# Altium project FAFMACMU_ControlPanel-V3-031115.PrjPcb
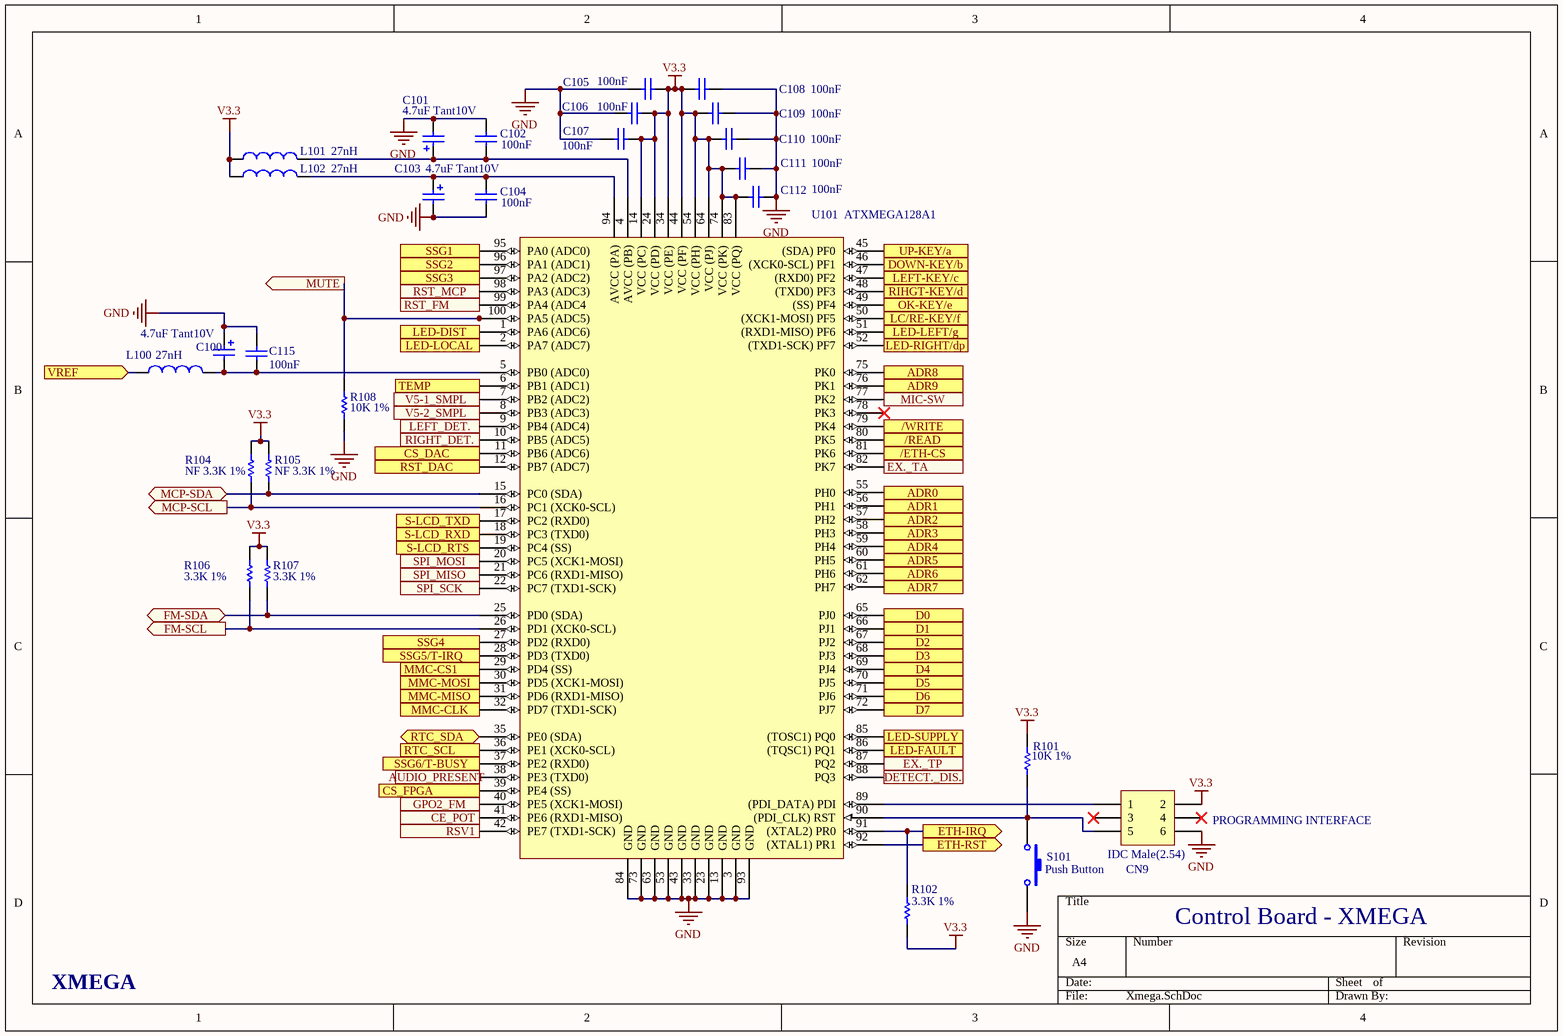
[diagram p0: Xmega.SchDoc]
4 sheets, 185 parts. Net scope: flat (ports and power ports of the same name join across sheets).
Board file: FAFMACMU_ControlPanel-V3-031115.PcbDoc
Sheets:
  Xmega.SchDoc
  Peripherals.SchDoc
  Ethernet & LCD.SchDoc
  Peripherals 2.SchDoc

## Sheet Xmega.SchDoc
size A4; PageSetup: Record=PageOptions|CenterHorizontal=True|CenterVertical=True|PrintScale=0.97|XCorrection=1.00|YCorrection=1.00|PrintKind=1|BorderSize=5000000|LeftOffset=0|BottomOffset=0|Orientation=2|PaperLength=2970|PaperWidth=1000|Scale=100|PaperSource=257|PrintQuality=600|MediaType=1|DitherType=10|PaperKind=A4|PrintScaleMode=1

### Parts
C100  4.7uF Tant10V  [CAP-TAN]
C101  4.7uF Tant10V  [A]
C102  100nF  [1206_FA]
C103  4.7uF Tant10V  [A]
C104  100nF  [1206_FA]
C105  100nF  [1206_FA]
C106  100nF  [1206_FA]
C107  100nF  [1206_FA]
C108  100nF  [1206_FA]
C109  100nF  [1206_FA]
C110  100nF  [1206_FA]
C111  100nF  [1206_FA]
C112  100nF  [1206_FA]
C115  100nF  [0805_FA]
CN9  IDC Male(2.54)  [HDR2X3_M]
L100  27nH  [1210_FA]
L101  27nH  [1210_FA]
L102  27nH  [1210_FA]
R101  10K 1%  [1206_FA]
R102  3.3K 1%  [1206_FA]
R104  NF 3.3K 1%  [1206_FA]
R105  NF 3.3K 1%  [1206_FA]
R106  3.3K 1%  [1206_FA]
R107  3.3K 1%  [1206_FA]
R108  10K 1%  [1206_FA]
S101  Push Button  [SPS2_M(2Pin)]
U101  ATXMEGA128A1  [100T1_N]

### Ports
/ETH-CS (out), /READ (out), /WRITE (out), ADR0 (out), ADR1 (out), ADR2 (out), ADR3 (out), ADR4 (out), ADR5 (out), ADR6 (out), ADR7 (out), ADR8 (out), ADR9 (out), AUDIO_PRESENT (out), CE_POT (in), CS_DAC (out), CS_FPGA (out), D0 (out), D1 (out), D2 (out), D3 (out), D4 (out), D5 (out), D6 (out), D7 (out), DETECT._DIS. (out), DOWN-KEY/b (out), ETH-IRQ (out), ETH-RST (out), EX._TA (out), EX._TP (out), FM-SCL (out), FM-SDA (bidir), GPO2_FM (out), LC/RE-KEY/f (out), LED-DIST (in), LED-FAULT (out), LED-LEFT/g (out), LED-LOCAL (in), LED-RIGHT/dp (out), LED-SUPPLY (out), LEFT-KEY/c (out), LEFT_DET. (in), MCP-SCL (out), MCP-SDA (bidir), MIC-SW (out), MMC-CLK (out), MMC-CS1 (out), MMC-MISO (in), MMC-MOSI (out), MUTE (out), OK-KEY/e (out), RIGHT_DET. (in), RIHGT-KEY/d (out), RST_DAC (out), RST_FM (out), RST_MCP (out), RSV1 (in), RTC_SCL (out), RTC_SDA (bidir), S-LCD_RTS (in), S-LCD_RXD (in), S-LCD_TXD (in), SPI_MISO (out), SPI_MOSI (out), SPI_SCK (out), SSG1 (in), SSG2 (in), SSG3 (in), SSG4 (out), SSG5/T-IRQ (out), SSG6/T-BUSY (out), TEMP (out), UP-KEY/a (out), V5-1_SMPL (in), V5-2_SMPL (in), VREF (in)

### Nets
GND: C100.1 C101.2 C102.2 C103.2 C104.1 C105.2 C106.2 C107.2 C108.1 C109.1 C110.1 C111.1 C112.1 C115.2 CN9.6 R108.1 S101.2 U101.3(GND) U101.13(GND) U101.23(GND) U101.33(GND) U101.43(GND) U101.53(GND) U101.63(GND) U101.73(GND) U101.84(GND) U101.93(GND)
V3.3: C105.1 C106.1 C107.1 C108.2 C109.2 C110.2 C111.2 C112.2 CN9.2 L101.1 L102.1 R101.2 R102.1 R104.2 R105.2 R106.2 R107.2 U101.14(VCC_(PC)) U101.24(VCC_(PD)) U101.34(VCC_(PE)) U101.44(VCC_(PF)) U101.54(VCC_(PH)) U101.64(VCC_(PJ)) U101.74(VCC_(PK)) U101.83(VCC_(PQ))
NetC100_2: C100.2 C115.1 L100.2 U101.5(PB0_(ADC0))
NetC101_1: C101.1 C102.1 L101.2 U101.4(AVCC_(PB))
NetC103_1: C103.1 C104.2 L102.2 U101.94(AVCC_(PA))
NetC314_2: U101.45((SDA)_PF0) ; port UP-KEY/a
NetC315_2: U101.46((XCK0-SCL)_PF1) ; port DOWN-KEY/b
NetC316_2: U101.47((RXD0)_PF2) ; port LEFT-KEY/c
NetC317_2: U101.48((TXD0)_PF3) ; port RIHGT-KEY/d
NetC318_2: U101.49((SS)_PF4) ; port OK-KEY/e
NetC319_2: U101.50((XCK1-MOSI)_PF5) ; port LC/RE-KEY/f
NetC403_2: U101.6(PB1_(ADC1)) ; port TEMP
NetCN9_1: CN9.1 U101.89((PDI_DATA)_PDI)
NetCN9_5: CN9.5 R101.1 S101.1 U101.90((PDI_CLK)_RST)
NetCN102_2: U101.98(PA3_(ADC3)) ; port RST_MCP
NetCN102_3: U101.11(PB6_(ADC6)) ; port CS_DAC
NetCN102_4: U101.20(PC5_(XCK1-MOSI)) ; port SPI_MOSI
NetCN102_5: U101.12(PB7_(ADC7)) ; port RST_DAC
NetCN102_6: U101.21(PC6_(RXD1-MISO)) ; port SPI_MISO
NetCN102_7: U101.22(PC7_(TXD1-SCK)) ; port SPI_SCK
NetCN102_8: U101.39(PE4_(SS)) ; port CS_FPGA
NetCN102_9: R107.1 U101.25(PD0_(SDA)) ; port FM-SDA
NetCN102_10: U101.99(PA4_(ADC4) ; port RST_FM
NetCN102_11: U101.40(PE5_(XCK1-MOSI)) ; port GPO2_FM
NetCN102_12: R106.1 U101.26(PD1_(XCK0-SCL)) ; port FM-SCL
NetCN102_13: U101.87(PQ2) ; port EX._TP
NetCN102_14: U101.88(PQ3) ; port DETECT._DIS.
NetCN102_15: U101.38(PE3_(TXD0)) ; port AUDIO_PRESENT
NetCN102_16: U101.77(PK2) ; port MIC-SW
NetCN102_17: U101.82(PK7) ; port EX._TA
NetCN102_18: R108.2 U101.100(PA5_(ADC5)) ; port MUTE
NetCN102_19: U101.41(PE6_(RXD1-MISO)) ; port CE_POT
NetCN102_20: U101.9(PB4_(ADC4)) ; port LEFT_DET.
NetCN102_21: U101.7(PB2_(ADC2)) ; port V5-1_SMPL
NetCN102_22: U101.10(PB5_(ADC5)) ; port RIGHT_DET.
NetCN102_23: U101.8(PB3_(ADC3)) ; port V5-2_SMPL
NetCN102_27: R105.1 U101.15(PC0_(SDA)) ; port MCP-SDA
NetCN102_29: R104.1 U101.16(PC1_(XCK0-SCL)) ; port MCP-SCL
NetCN103_7: U101.51((RXD1-MISO)_PF6) ; port LED-LEFT/g
NetCN103_8: U101.52((TXD1-SCK)_PF7) ; port LED-RIGHT/dp
NetCN103_10: U101.95(PA0_(ADC0)) ; port SSG1
NetCN103_12: U101.96(PA1_(ADC1)) ; port SSG2
NetCN103_14: U101.97(PA2_(ADC2)) ; port SSG3
NetCN104_10: U101.27(PD2_(RXD0)) ; port SSG4
NetCN104_12: U101.28(PD3_(TXD0)) ; port SSG5/T-IRQ
NetCN104_14: U101.37(PE2_(RXD0)) ; port SSG6/T-BUSY
NetE400_1: U101.18(PC3_(TXD0)) ; port S-LCD_RXD
NetE401_1: U101.19(PC4_(SS)) ; port S-LCD_RTS
NetE402_1: U101.17(PC2_(RXD0)) ; port S-LCD_TXD
NetL100_1: L100.1 ; port VREF
NetLED105_K: U101.2(PA7_(ADC7)) ; port LED-LOCAL
NetLED106_A: U101.86((TQSC1)_PQ1) ; port LED-FAULT
NetR102_2: R102.2 U101.91((XTAL2)_PR0) ; port ETH-IRQ
NetR301_2: U101.31(PD6_(RXD1-MISO)) ; port MMC-MISO
NetR302_2: U101.32(PD7_(TXD1-SCK)) ; port MMC-CLK
NetR303_2: U101.30(PD5_(XCK1-MOSI)) ; port MMC-MOSI
NetR304_2: U101.29(PD4_(SS)) ; port MMC-CS1
NetR312_1: U101.1(PA6_(ADC6)) ; port LED-DIST
NetR315_1: U101.85((TOSC1)_PQ0) ; port LED-SUPPLY
NetR405_1: U101.35(PE0_(SDA)) ; port RTC_SDA
NetR406_1: U101.36(PE1_(XCK0-SCL)) ; port RTC_SCL
NetU101_42: U101.42(PE7_(TXD1-SCK)) ; port RSV1
NetU101_55: U101.55(PH0) ; port ADR0
NetU101_56: U101.56(PH1) ; port ADR1
NetU101_57: U101.57(PH2) ; port ADR2
NetU101_58: U101.58(PH3) ; port ADR3
NetU101_59: U101.59(PH4) ; port ADR4
NetU101_60: U101.60(PH5) ; port ADR5
NetU101_61: U101.61(PH6) ; port ADR6
NetU101_62: U101.62(PH7) ; port ADR7
NetU101_65: U101.65(PJ0) ; port D0
NetU101_66: U101.66(PJ1) ; port D1
NetU101_67: U101.67(PJ2) ; port D2
NetU101_68: U101.68(PJ3) ; port D3
NetU101_69: U101.69(PJ4) ; port D4
NetU101_70: U101.70(PJ5) ; port D5
NetU101_71: U101.71(PJ6) ; port D6
NetU101_72: U101.72(PJ7) ; port D7
NetU101_75: U101.75(PK0) ; port ADR8
NetU101_76: U101.76(PK1) ; port ADR9
NetU101_79: U101.79(PK4) ; port /WRITE
NetU101_80: U101.80(PK5) ; port /READ
NetU101_81: U101.81(PK6) ; port /ETH-CS
NetU101_92: U101.92((XTAL1)_PR1) ; port ETH-RST

Not connected (* = marked no-connect by the designer): CN9 3* 4*; U101 78(PK3)*

### Notes on the sheet
- (near CN9) PROGRAMMING INTERFACE
- XMEGA
- Control Board - XMEGA

### Library data of the parts
C100 C101 C103 = Cap Pol3: Polarized Capacitor (Surface Mount); Value: 100pF; Published: 8-Jun-2000; LatestRevisionDate: 17-Jul-2002; LatestRevisionNote: Re-released for DXP Platform.; PackageReference: C0805; Publisher: Altium Limited
C102 C104-C112 = Cap Semi: Capacitor (Semiconductor SIM Model); Value: 100pF; Published: 8-Jun-2000; LatestRevisionDate: 17-Jul-2002; LatestRevisionNote: Re-released for DXP Platform.; PackageReference: C1206; Publisher: Altium Limited
C115 = Cap Semi: Capacitor (Semiconductor SIM Model); Published: 8-Jun-2000; LatestRevisionDate: 29-May-2009; LatestRevisionNote: IPC-7351 Footprint Added.; PackageReference: C1206; Publisher: Altium Limited; PackageDescription: Chip Capacitor; Value: 100nF
CN9 = Header 3X2: LatestRevisionDate: 17-Jul-2002; LatestRevisionNote: Re-released for DXP Platform.; Publisher: Altium Limited
L100-L102 = Inductor: Code_IEC: 1005; Published: 8-Jun-2000; LatestRevisionDate: 17-Jul-2002; LatestRevisionNote: Re-released for DXP Platform.; PackageReference: 0402-A; Publisher: Altium Limited; Code_JEITA: 0402
R101 R102 R104-R108 = Res Semi: Semiconductor Resistor; Value: 1K; Published: 8-Jun-2000; LatestRevisionDate: 17-Jul-2002; LatestRevisionNote: Re-released for DXP Platform.; PackageReference: AXIAL-0.5; Publisher: Altium Limited
S101 = SW-PB: Switch; Published: 24-Mar-1999; LatestRevisionDate: 17-Jul-2002; LatestRevisionNote: Re-released for DXP Platform.; PackageReference: SPST-2; Publisher: Altium Limited
U101 = ATMEGA163_DIP40: Atmel Microcontroller - Library created by carel..  <www.mpfreezone.com>

## Sheet Peripherals.SchDoc
size A4
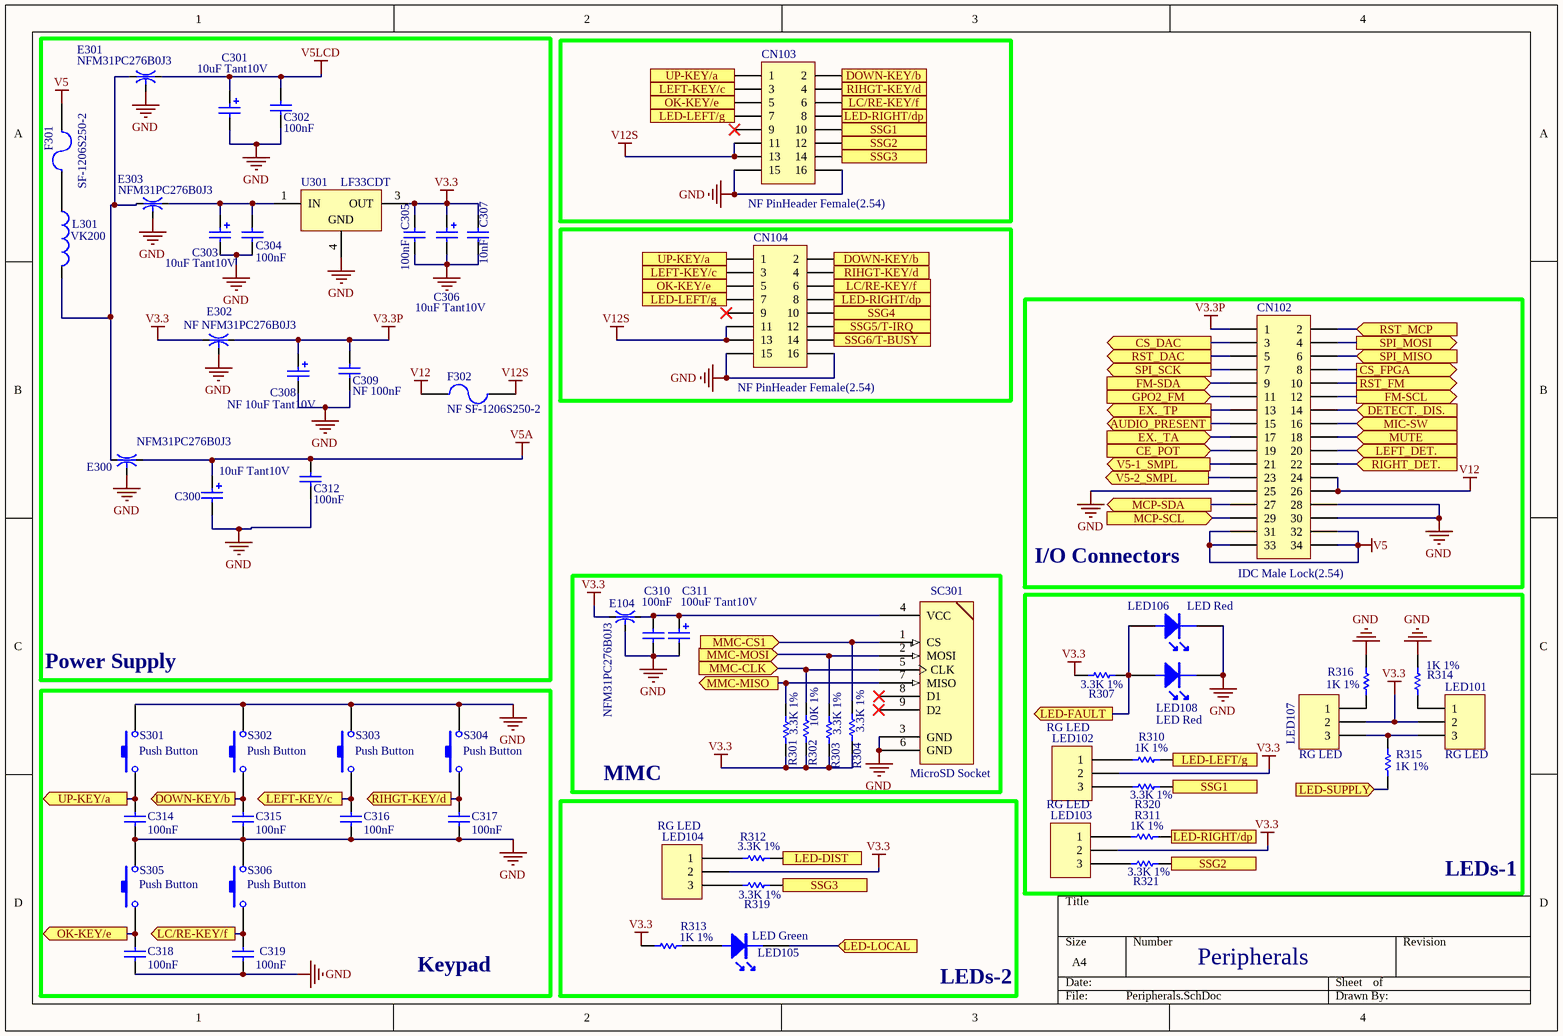
[diagram p1: Peripherals.SchDoc]

### Parts
C300  10uF Tant10V  [A]
C301  10uF Tant10V  [A]
C302  100nF  [1206_FA]
C303  10uF Tant10V  [A]
C304  100nF  [1206_FA]
C305  100nF  [1206_FA]
C306  10uF Tant10V  [A]
C307  10nF  [1206_FA]
C308  NF 10uF Tant10V  [A]
C309  NF 100nF  [1206_FA]
C310  100nF  [1206_FA]
C311  100uF Tant10V  [C]
C312  100nF  [1206_FA]
C314  100nF  [1206_FA]
C315  100nF  [1206_FA]
C316  100nF  [1206_FA]
C317  100nF  [1206_FA]
C318  100nF  [1206_FA]
C319  100nF  [1206_FA]
CN102  IDC Male Lock(2.54)  [IDC_LOCK 2X17]
CN103  NF PinHeader Female(2.54)  [HDR2*8_M]
CN104  NF PinHeader Female(2.54)  [HDR2*8_M]
E104  NFM31PC276B0J3  [EMI1206]
E300  NFM31PC276B0J3  [EMI-1206]
E301  NFM31PC276B0J3  [EMI1206]
E302  NF NFM31PC276B0J3  [EMI1206]
E303  NFM31PC276B0J3  [EMI1206]
F301  SF-1206S250-2  [1206_FA]
F302  NF SF-1206S250-2  [1206_FA]
L301  VK200  [VK200]
LED101  RG LED  [LED3CA]
LED102  RG LED  [LED3CA]
LED103  RG LED  [LED3CA]
LED104  RG LED  [LED3CA]
LED105  LED Green  [LED RADIALl 0.1]
LED106  LED Red  [LED RADIALl 0.1]
LED107  RG LED  [LED3CA]
LED108  LED Red  [LED RADIALl 0.1]
R301  3.3K 1%  [1206_FA]
R302  10K 1%  [1206_FA]
R303  3.3K 1%  [1206_FA]
R304  3.3K 1%  [1206_FA]
R307  3.3K 1%  [1206_FA]
R310  1K 1%  [1206_FA]
R311  1K 1%  [1206_FA]
R312  3.3K 1%  [1206_FA]
R313  1K 1%  [1206_FA]
R314  1K 1%  [1206_FA]
R315  1K 1%  [1206_FA]
R316  1K 1%  [1206_FA]
R319  3.3K 1%  [1206_FA]
R320  3.3K 1%  [1206_FA]
R321  3.3K 1%  [1206_FA]
S301  value Push Button  [Push Bottom  12*12*22]  (hidden comment: Push Button 12x12x22)
S302  value Push Button  [Push Bottom  12*12*22]  (hidden comment: Push Button 12x12x22)
S303  value Push Button  [Push Bottom  12*12*22]  (hidden comment: Push Button 12x12x22)
S304  value Push Button  [Push Bottom  12*12*22]  (hidden comment: Push Button 12x12x22)
S305  value Push Button  [Push Bottom  12*12*22]  (hidden comment: Push Button 12x12x22)
S306  value Push Button  [Push Bottom  12*12*22]  (hidden comment: Push Button 12x12x22)
SC301  MicroSD Socket  [Micro SD Sock.]
U301  LF33CDT  [TO-252]

### Blocks framed on the sheet
Power Supply: C300-C309 C312 E300-E303 F301 F302 L301 U301
I/O Connectors: CN102
MMC: C310 C311 E104 R301-R304 SC301
LEDs-1: LED101-LED103 LED106-LED108 R307 R310 R311 R314-R316 R320 R321

### Ports
AUDIO_PRESENT (out), CE_POT (in), CS_DAC (out), CS_FPGA (out), DETECT._DIS. (in), DOWN-KEY/b (out), EX._TA (in), EX._TP (out), FM-SCL (out), FM-SDA (in), GPO2_FM (in), LC/RE-KEY/f (out), LED-DIST (in), LED-FAULT (out), LED-LEFT/g (out), LED-LOCAL (in), LED-RIGHT/dp (out), LED-SUPPLY (in), LEFT-KEY/c (out), LEFT_DET. (in), MCP-SCL (in), MCP-SDA (out), MIC-SW (in), MMC-CLK (in), MMC-CS1 (in), MMC-MISO (out), MMC-MOSI (in), MUTE (in), OK-KEY/e (out), RIGHT_DET. (in), RIHGT-KEY/d (out), RST_DAC (out), RST_FM (out), RST_MCP (in), SPI_MISO (in), SPI_MOSI (out), SPI_SCK (out), SSG1 (out), SSG2 (out), SSG3 (out), SSG4 (out), SSG5/T-IRQ (out), SSG6/T-BUSY (out), UP-KEY/a (out), V5-1_SMPL (out), V5-2_SMPL (out)

### Nets
GND: C300.2 C301.2 C302.1 C303.2 C304.1 C305.1 C306.2 C307.1 C308.2 C309.1 C310.2 C311.2 C312.1 C314.1 C315.1 C316.1 C317.1 C318.1 C319.1 CN102.25 CN102.28 CN102.30 CN103.15 CN103.16 CN104.15 CN104.16 E104.2 E300.2 E301.2 E302.2 E303.2 LED106.K LED108.K R314.2 R316.2 S301.2 S302.2 S303.2 S304.2 S305.2 S306.2 SC301.3(GND) SC301.6(GND) U301.4(GND)
V3.3: C305.2 C306.1 C307.2 E104.1 E302.1 LED101.2 LED102.2 LED103.2 LED104.2 LED107.2 R301.1 R302.1 R303.1 R304.1 R307.2 R313.2 U301.3(OUT)
V3.3P: C308.1 C309.2 CN102.1 E302.3
V5: CN102.31 CN102.32 CN102.33 CN102.34 F301.2
V5A: C300.1 C312.2 E300.3
V5LCD: C301.1 C302.2 E301.3
V12: CN102.24 CN102.26 F302.1
V12S: CN103.11 CN103.13 CN104.11 CN104.13 F302.2
NetC303_1: C303.1 C304.2 E303.3 U301.1(IN)
NetC310_1: C310.1 C311.1 E104.3 SC301.4(VCC)
NetC314_2: C314.2 CN103.1 CN104.1 S301.1 ; port UP-KEY/a
NetC315_2: C315.2 CN103.2 CN104.2 S302.1 ; port DOWN-KEY/b
NetC316_2: C316.2 CN103.3 CN104.3 S303.1 ; port LEFT-KEY/c
NetC317_2: C317.2 CN103.4 CN104.4 S304.1 ; port RIHGT-KEY/d
NetC318_2: C318.2 CN103.5 CN104.5 S305.1 ; port OK-KEY/e
NetC319_2: C319.2 CN103.6 CN104.6 S306.1 ; port LC/RE-KEY/f
NetCN102_2: CN102.2 ; port RST_MCP
NetCN102_3: CN102.3 ; port CS_DAC
NetCN102_4: CN102.4 ; port SPI_MOSI
NetCN102_5: CN102.5 ; port RST_DAC
NetCN102_6: CN102.6 ; port SPI_MISO
NetCN102_7: CN102.7 ; port SPI_SCK
NetCN102_8: CN102.8 ; port CS_FPGA
NetCN102_9: CN102.9 ; port FM-SDA
NetCN102_10: CN102.10 ; port RST_FM
NetCN102_11: CN102.11 ; port GPO2_FM
NetCN102_12: CN102.12 ; port FM-SCL
NetCN102_13: CN102.13 ; port EX._TP
NetCN102_14: CN102.14 ; port DETECT._DIS.
NetCN102_15: CN102.15 ; port AUDIO_PRESENT
NetCN102_16: CN102.16 ; port MIC-SW
NetCN102_17: CN102.17 ; port EX._TA
NetCN102_18: CN102.18 ; port MUTE
NetCN102_19: CN102.19 ; port CE_POT
NetCN102_20: CN102.20 ; port LEFT_DET.
NetCN102_21: CN102.21 ; port V5-1_SMPL
NetCN102_22: CN102.22 ; port RIGHT_DET.
NetCN102_23: CN102.23 ; port V5-2_SMPL
NetCN102_27: CN102.27 ; port MCP-SDA
NetCN102_29: CN102.29 ; port MCP-SCL
NetCN103_7: CN103.7 CN104.7 R310.1 ; port LED-LEFT/g
NetCN103_8: CN103.8 CN104.8 R311.1 ; port LED-RIGHT/dp
NetCN103_10: CN103.10 R320.1 ; port SSG1
NetCN103_12: CN103.12 R321.1 ; port SSG2
NetCN103_14: CN103.14 R319.1 ; port SSG3
NetCN104_10: CN104.10 ; port SSG4
NetCN104_12: CN104.12 ; port SSG5/T-IRQ
NetCN104_14: CN104.14 ; port SSG6/T-BUSY
NetE300_1: E300.1 E301.1 E303.1 L301.2
NetF301_1: F301.1 L301.1
NetLED101_1: LED101.1 R314.1
NetLED101_3: LED101.3 LED107.3 R315.2
NetLED102_1: LED102.1 R310.2
NetLED102_3: LED102.3 R320.2
NetLED103_1: LED103.1 R311.2
NetLED103_3: LED103.3 R321.2
NetLED104_1: LED104.1 R312.2
NetLED104_3: LED104.3 R319.2
NetLED105_A: LED105.A R313.1
NetLED105_K: LED105.K ; port LED-LOCAL
NetLED106_A: LED106.A LED108.A R307.1 ; port LED-FAULT
NetLED107_1: LED107.1 R316.1
NetR301_2: R301.2 SC301.7(MISO) ; port MMC-MISO
NetR302_2: R302.2 SC301.5(CLK) ; port MMC-CLK
NetR303_2: R303.2 SC301.2(MOSI) ; port MMC-MOSI
NetR304_2: R304.2 SC301.1(CS) ; port MMC-CS1
NetR312_1: R312.1 ; port LED-DIST
NetR315_1: R315.1 ; port LED-SUPPLY

Not connected (* = marked no-connect by the designer): CN103 9*; CN104 9*; SC301 8(D1)* 9(D2)*

### Notes on the sheet
- Keypad
- LEDs-2
- Peripherals

### Library data of the parts
C300 C301 C303 C306 C308 C311 = Cap Pol3: as C100 on sheet Xmega; Published: 8-Jun-2000; LatestRevisionDate: 17-Jul-2002; LatestRevisionNote: Re-released for DXP Platform.; PackageReference: C0805; Publisher: Altium Limited
C302 C304 C305 C307 C309 C310 C312 C314-C319 = Cap Semi: as C102 on sheet Xmega; Published: 8-Jun-2000; PackageReference: C1206; Publisher: Altium Limited; LatestRevisionDate: 17-Jul-2002; LatestRevisionNote: Re-released for DXP Platform.
CN102 = Header 17X2: Header, 17-Pin, Dual row; LatestRevisionDate: 17-Jul-2002; LatestRevisionNote: Re-released for DXP Platform.; Publisher: Altium Limited
CN103 CN104 = Header 8X2: Header, 8-Pin, Dual row; LatestRevisionDate: 17-Jul-2002; LatestRevisionNote: Re-released for DXP Platform.; Publisher: Altium Limited
E104 E300-E303 = Component_1
F301 F302 = Fuse 2: Fuse; Published: 8-Jun-2000; LatestRevisionDate: 17-Jul-2002; LatestRevisionNote: Re-released for DXP Platform.; PackageReference: PIN-W2/E2.8; Publisher: Altium Limited
L301 = Inductor: Code_IEC: 1005; Published: 8-Jun-2000; LatestRevisionDate: 17-Jul-2002; LatestRevisionNote: Re-released for DXP Platform.; PackageReference: 0402-A; Publisher: Altium Limited; Code_JEITA: 0402
LED101-LED104 LED107 = Header 3H: Header, 3-Pin, Right Angle; LatestRevisionDate: 17-Jul-2002; LatestRevisionNote: Re-released for DXP Platform.; Publisher: Altium Limited
LED105 LED106 LED108 = LED
R301-R304 R307 R312 R319-R321 = Res Semi: Semiconductor Resistor; Value: 1K; Published: 8-Jun-2000; LatestRevisionDate: 17-Jul-2002; LatestRevisionNote: Re-released for DXP Platform.; PackageReference: AXIAL-0.5; Publisher: Altium Limited
R310 R311 R313-R316 = Res Semi: Semiconductor Resistor; Published: 8-Jun-2000; LatestRevisionDate: 17-Jul-2002; LatestRevisionNote: Re-released for DXP Platform.; PackageReference: AXIAL-0.5; Publisher: Altium Limited; Value: 1K
S301-S306 = SW-PB: Switch; Published: 24-Mar-1999; LatestRevisionDate: 17-Jul-2002; LatestRevisionNote: Re-released for DXP Platform.; PackageReference: SPST-2; Publisher: Altium Limited
SC301 = ATMEGA163_DIP40: as U101 on sheet Xmega
U301 = LF33CDT: 500mA, Very Low Drop (0.45V) Voltage Regulator; Published: 24-Aug-2001; LatestRevisionDate: 06-Jun-2005; LatestRevisionNote: PCB pads lengthened.; DatasheetVersion: Feb-2004; PackageVersion: Jun-2004; PackageReference: TO-252; Publisher: Altium Limited; PackageDescription: D-PAK/TO-252-AA; 3 Leads (1 Cropped); Body 10.1 (inc. leads) x 6.6 mm (LxW max); ComponentLink1Description: Manufacturer Link; ComponentLink1URL: http://www.st.com/; ComponentLink2Description: Datasheet; ComponentLink2URL: http://www.st.com/stonline/books/pdf/docs/2574.pdf

## Sheet Ethernet & LCD.SchDoc
size A4
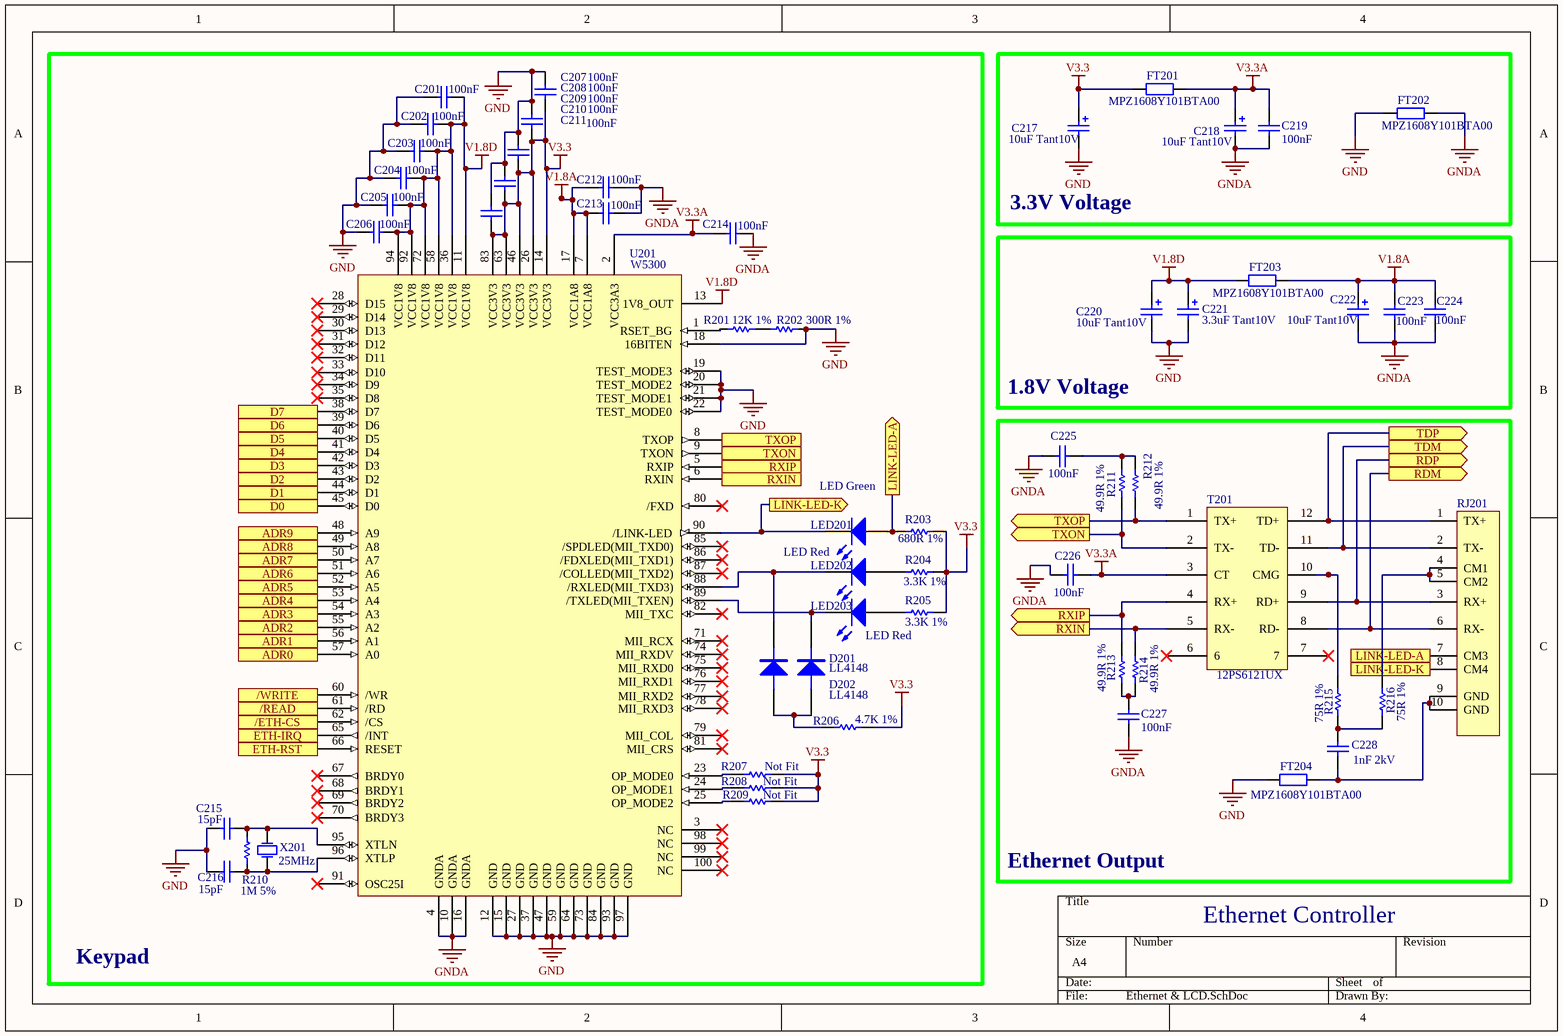
[diagram p2: Ethernet & LCD.SchDoc]

### Parts
C201  100nF  [1206_FA]
C202  100nF  [1206_FA]
C203  100nF  [1206_FA]
C204  100nF  [1206_FA]
C205  100nF  [1206_FA]
C206  100nF  [1206_FA]
C207  100nF  [1206_FA]
C208  100nF  [1206_FA]
C209  100nF  [1206_FA]
C210  100nF  [1206_FA]
C211  100nF  [1206_FA]
C212  100nF  [1206_FA]
C213  100nF  [1206_FA]
C214  100nF  [1206_FA]
C215  15pF  [1206_FA]
C216  15pF  [1206_FA]
C217  10uF Tant10V  [A]
C218  10uF Tant10V  [A]
C219  100nF  [1206_FA]
C220  10uF Tant10V  [A]
C221  3.3uF Tant10V  [A]
C222  10uF Tant10V  [A]
C223  100nF  [1206_FA]
C224  100nF  [1206_FA]
C225  100nF  [1206_FA]
C226  100nF  [1206_FA]
C227  100nF  [1206_FA]
C228  1nF 2kV  [1206_FA]
D201  LL4148  [MiniMelf]
D202  LL4148  [MiniMelf]
FT201  MPZ1608Y101BTA00  [0603]
FT202  MPZ1608Y101BTA00  [0603]
FT203  MPZ1608Y101BTA00  [0603]
FT204  MPZ1608Y101BTA00  [0603]
LED201  LED Green  [LEDSMD_1206]
LED202  LED Red  [LEDSMD_1206]
LED203  LED Red  [LEDSMD_1206]
R201  12K 1%  [1206_FA]
R202  300R 1%  [1206_FA]
R203  680R 1%  [1206_FA]
R204  3.3K 1%  [1206_FA]
R205  3.3K 1%  [1206_FA]
R206  4.7K 1%  [1206_FA]
R207  Not Fit  [1206_FA]
R208  Not Fit  [1206_FA]
R209  Not Fit  [1206_FA]
R210  1M 5%  [1206_FA]
R211  49.9R 1%  [1206_FA]
R212  49.9R 1%  [1206_FA]
R213  49.9R 1%  [1206_FA]
R214  49.9R 1%  [1206_FA]
R215  75R 1%  [1206_FA]
R216  75R 1%  [1206_FA]
RJ201  (no value)  [RJ45b]
T201  12PS6121UX  [12PS6121UX-DATA]
U201  W5300  [100T1_N]
X201  25MHz  [CRYSTAL 25.000MHZ]

### Blocks framed on the sheet
Keypad: C201-C216 D201 D202 LED201-LED203 R201-R210 U201 X201
3.3V Voltage: C217-C219 FT201 FT202
1.8V Voltage: C220-C224 FT203
Ethernet Output: C225-C228 FT204 R211-R216 RJ201 T201

### Ports
/ETH-CS (out), /READ (out), /WRITE (out), ADR0 (out), ADR1 (out), ADR2 (out), ADR3 (out), ADR4 (out), ADR5 (out), ADR6 (out), ADR7 (out), ADR8 (out), ADR9 (out), D0 (out), D1 (out), D2 (out), D3 (out), D4 (out), D5 (out), D6 (out), D7 (out), ETH-IRQ (out), ETH-RST (out), LINK-LED-A (out), LINK-LED-K (out), RDM (out), RDP (out), RXIN (out), RXIP (out), TDM (out), TDP (out), TXON (out), TXOP (out)

### Nets
GND: C201.2 C202.2 C203.2 C204.2 C205.2 C206.2 C207.1 C208.1 C209.1 C210.1 C211.1 C215.2 C216.2 C217.2 C220.2 C221.2 FT202.1 FT204.1 R202.2 U201.12(GND) U201.15(GND) U201.18(16BITEN) U201.19(TEST_MODE3) U201.20(TEST_MODE2) U201.21(TEST_MODE1) U201.22(TEST_MODE0) U201.27(GND) U201.37(GND) U201.47(GND) U201.59(GND) U201.64(GND) U201.73(GND) U201.84(GND) U201.93(GND) U201.97(GND)
GNDA: C212.1 C213.1 C214.1 C218.2 C219.1 C222.2 C223.1 C224.1 C225.1 C226.1 C227.1 FT202.2 U201.4(GNDA) U201.10(GNDA) U201.16(GNDA)
V1.8A: C212.2 C213.2 C222.1 C223.2 C224.2 FT203.2 U201.7(VCC1A8) U201.17(VCC1A8)
V1.8D: C201.1 C202.1 C203.1 C204.1 C205.1 C206.1 C220.1 C221.1 FT203.1 U201.11(VCC1V8) U201.13(1V8_OUT) U201.36(VCC1V8) U201.58(VCC1V8) U201.72(VCC1V8) U201.92(VCC1V8) U201.94(VCC1V8)
V3.3: C207.2 C208.2 C209.2 C210.2 C211.2 C217.1 FT201.1 R203.2 R204.2 R205.2 R206.2 R207.2 R208.2 R209.2 U201.14(VCC3V3) U201.26(VCC3V3) U201.46(VCC3V3) U201.63(VCC3V3) U201.83(VCC3V3)
V3.3A: C214.2 C218.1 C219.2 C226.2 FT201.2 T201.3(CT) U201.2(VCC3A3)
NetC215_1: C215.1 R210.1 U201.95(XTLN) X201.1(OSC1)
NetC216_1: C216.1 R210.2 U201.96(XTLP) X201.2(OSC2)
NetC225_2: C225.2 R211.2 R212.2
NetC227_2: C227.2 R213.1 R214.1
NetC228_1: C228.1 FT204.2 RJ201.9(GND) RJ201.10(GND)
NetC228_2: C228.2 R215.1 R216.1
NetD201_1: D201.1(A) D202.1(A) R206.1
NetD201_2: D201.2(K) LED203.2(K) U201.89(/TXLED(MII_TXEN))
NetD202_2: D202.2(K) LED202.2(K) U201.88(/RXLED(MII_TXD3))
NetLED201_1: LED201.1(A) R203.1 RJ201.7(CM3) ; port LINK-LED-A
NetLED201_2: LED201.2(K) RJ201.8(CM4) U201.90(/LINK-LED) ; port LINK-LED-K
NetLED202_1: LED202.1(A) R204.1
NetLED203_1: LED203.1(A) R205.1
NetR102_2: U201.65(/INT) ; port ETH-IRQ
NetR201_1: R201.1 U201.1(RSET_BG)
NetR201_2: R201.2 R202.1
NetR207_1: R207.1 U201.23(OP_MODE0)
NetR208_1: R208.1 U201.24(OP_MODE1)
NetR209_1: R209.1 U201.25(OP_MODE2)
NetR211_1: R211.1 T201.2(TX-) U201.9(TXON) ; port TXON
NetR212_1: R212.1 T201.1(TX+) U201.8(TXOP) ; port TXOP
NetR213_2: R213.2 T201.4(RX+) U201.5(RXIP) ; port RXIP
NetR214_2: R214.2 T201.5(RX-) U201.6(RXIN) ; port RXIN
NetR215_2: R215.2 T201.10(CMG)
NetR216_2: R216.2 RJ201.4(CM1) RJ201.5(CM2)
NetRJ201_1: RJ201.1(TX+) T201.12(TD+) ; port TDP
NetRJ201_2: RJ201.2(TX-) T201.11(TD-) ; port TDM
NetRJ201_3: RJ201.3(RX+) T201.9(RD+) ; port RDP
NetRJ201_6: RJ201.6(RX-) T201.8(RD-) ; port RDM
NetU101_55: U201.57(A0) ; port ADR0
NetU101_56: U201.56(A1) ; port ADR1
NetU101_57: U201.55(A2) ; port ADR2
NetU101_58: U201.54(A3) ; port ADR3
NetU101_59: U201.53(A4) ; port ADR4
NetU101_60: U201.52(A5) ; port ADR5
NetU101_61: U201.51(A6) ; port ADR6
NetU101_62: U201.50(A7) ; port ADR7
NetU101_65: U201.45(D0) ; port D0
NetU101_66: U201.44(D1) ; port D1
NetU101_67: U201.43(D2) ; port D2
NetU101_68: U201.42(D3) ; port D3
NetU101_69: U201.41(D4) ; port D4
NetU101_70: U201.40(D5) ; port D5
NetU101_71: U201.39(D6) ; port D6
NetU101_72: U201.38(D7) ; port D7
NetU101_75: U201.49(A8) ; port ADR8
NetU101_76: U201.48(A9) ; port ADR9
NetU101_79: U201.60(/WR) ; port /WRITE
NetU101_80: U201.61(/RD) ; port /READ
NetU101_81: U201.62(/CS) ; port /ETH-CS
NetU101_92: U201.66(RESET) ; port ETH-RST

Not connected (* = marked no-connect by the designer): T201 6* 7*; U201 3(NC)* 28(D15)* 29(D14)* 30(D13)* 31(D12)* 32(D11)* 33(D10)* 34(D9)* 35(D8)* 67(BRDY0)* 68(BRDY1)* 69(BRDY2)* 70(BRDY3)* 71(MII_RCX)* 74(MII_RXDV)* 75(MII_RXD0)* 76(MII_RXD1)* 77(MII_RXD2)* 78(MII_RXD3)* 79(MII_COL)* 80(/FXD)* 81(MII_CRS)* 82(MII_TXC)* 85(/SPDLED(MII_TXD0))* 86(/FDXLED(MII_TXD1))* 87(/COLLED(MII_TXD2))* 91(OSC25I)* 98(NC)* 99(NC)* 100(NC)*

### Notes on the sheet
- Ethernet Controller

### Library data of the parts
C201-C216 C219 C223-C227 = Cap Semi: as C102 on sheet Xmega; Published: 8-Jun-2000; LatestRevisionDate: 17-Jul-2002; LatestRevisionNote: Re-released for DXP Platform.; PackageReference: C1206; Publisher: Altium Limited
C217 C218 C220-C222 = Cap Pol3: as C100 on sheet Xmega; Published: 8-Jun-2000; LatestRevisionDate: 17-Jul-2002; LatestRevisionNote: Re-released for DXP Platform.; PackageReference: C0805; Publisher: Altium Limited
C228 = Cap: Capacitor; Value: 100pF; Published: 8-Jun-2000; LatestRevisionDate: 17-Jul-2002; LatestRevisionNote: Re-released for DXP Platform.; PackageReference: RAD-0.3; Publisher: Altium Limited
D201 D202 = DIODE
FT201-FT204 = Res2: Resistor; Value: 1K; Published: 8-Jun-2000; LatestRevisionDate: 17-Jul-2002; LatestRevisionNote: Re-released for DXP Platform.; PackageReference: AXIAL-0.4; Publisher: Altium Limited
LED201-LED203 = LED2: Typical RED, GREEN, YELLOW, AMBER GaAs LED; Published: 8-Jun-2000; LatestRevisionDate: 17-Jul-2002; LatestRevisionNote: Re-released for DXP Platform.; PackageDocument: Feb-2002; PackageReference: 3.2X1.6X1.1; Publisher: Altium Limited
R201-R216 = Res Semi: Semiconductor Resistor; Value: 1K; Published: 8-Jun-2000; LatestRevisionDate: 17-Jul-2002; LatestRevisionNote: Re-released for DXP Platform.; PackageReference: AXIAL-0.5; Publisher: Altium Limited
RJ201 = rj45
T201 = Component_1
U201 = ATMEGA163_DIP40: as U101 on sheet Xmega
X201 = XTAL: Crystal Oscillator; Published: 8-Jun-2000; LatestRevisionDate: 17-Jul-2002; LatestRevisionNote: Re-released for DXP Platform.; PackageReference: R38; Publisher: Altium Limited

## Sheet Peripherals 2.SchDoc
size A4
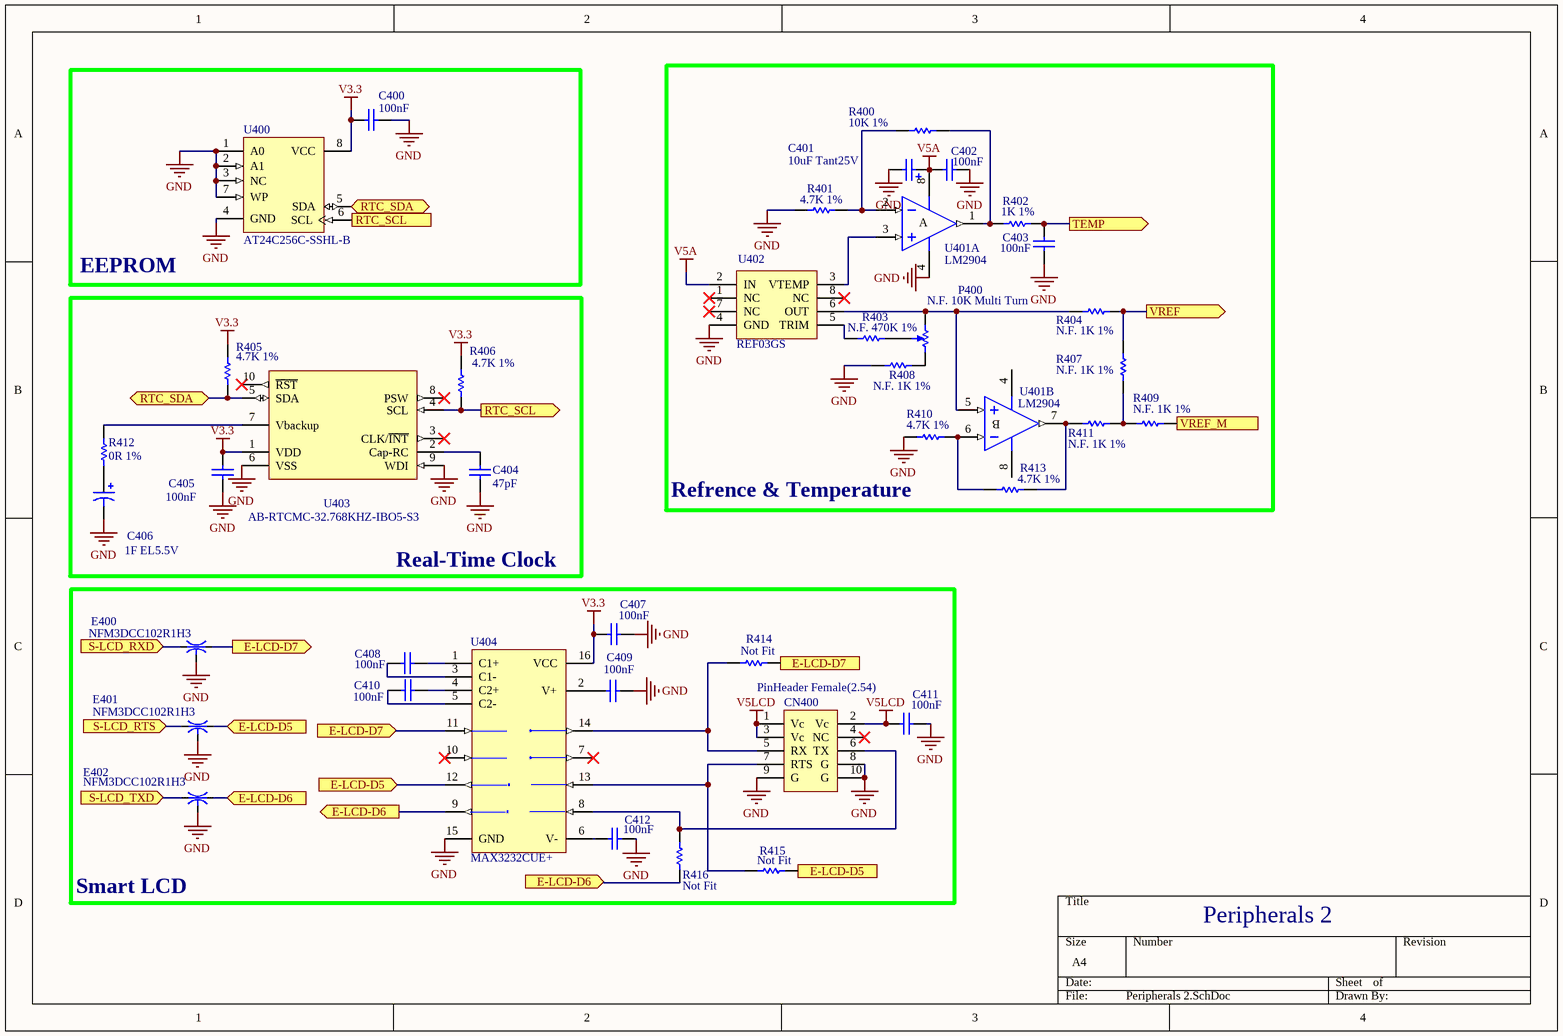
[diagram p3: Peripherals 2.SchDoc]

### Parts
C400  100nF  [0805_FA]
C401  10uF Tant25V  [B]
C402  100nF  [0805_FA]
C403  100nF  [0805_FA]
C404  47pF  [1206_FA]
C405  100nF  [0805_FA]
C406  1F EL5.5V  [CAP1F]
C407  100nF  [0805_FA]
C408  100nF  [1206_FA]
C409  100nF  [1206_FA]
C410  100nF  [1206_FA]
C411  100nF  [1206_FA]
C412  100nF  [1206_FA]
CN400  PinHeader Female(2.54)  [HDR2*5]
E400  NFM3DCC102R1H3  [EMI-1206]
E401  NFM3DCC102R1H3  [EMI-1206]
E402  NFM3DCC102R1H3  [EMI-1206]
P400  N.F. 10K Multi Turn  [3224W]
R400  10K 1%  [1206_FA]
R401  4.7K 1%  [1206_FA]
R402  1K 1%  [1206_FA]
R403  N.F. 470K 1%  [1206_FA]
R404  N.F. 1K 1%  [1206_FA]
R405  4.7K 1%  [1206_FA]
R406  4.7K 1%  [1206_FA]
R407  N.F. 1K 1%  [1206_FA]
R408  N.F. 1K 1%  [1206_FA]
R409  N.F. 1K 1%  [1206_FA]
R410  4.7K 1%  [1206_FA]
R411  N.F. 1K 1%  [1206_FA]
R412  0R 1%  [1206_FA]
R413  4.7K 1%  [1206_FA]
R414  Not Fit  [1206_FA]
R415  Not Fit  [1206_FA]
R416  Not Fit  [1206_FA]
U400  AT24C256C-SSHL-B  [SO8_N]
U401  LM2904  [SO8_N]  (parts A,B of 2)
U402  REF03GS  [SO8_N]
U403  AB-RTCMC-32.768KHZ-IBO5-S3  [VDFN-10]
U404  MAX3232CUE+  [SO16_N]

### Blocks framed on the sheet
EEPROM: C400 U400
Refrence & Temperature: C401-C403 P400 R400-R404 R407-R411 R413 U401 U402
Real-Time Clock: C404-C406 R405 R406 R412 U403
Smart LCD: C407-C412 CN400 E400-E402 R414-R416 U404

### Ports
E-LCD-D5 (in), E-LCD-D6 (in), E-LCD-D6 (out), E-LCD-D7 (in), E-LCD-D7 (out), RTC_SCL (out), RTC_SDA (bidir), S-LCD_RTS (in), S-LCD_RXD (in), S-LCD_TXD (in), TEMP (out), VREF (out), VREF_M (out)

### Nets
GND: C400.2 C401.2 C402.1 C403.1 C404.2 C405.2 C406.2 C407.2 C409.2 C411.2 C412.1 CN400.8(G) CN400.9(G) CN400.10(G) E400.2 E401.2 E402.2 R401.2 R408.2 R410.2 U400.1(A0) U400.2(A1) U400.3(NC) U400.4(GND) U400.7(WP) U401.4(V-) U402.4(GND) U403.6(VSS) U403.9(WDI) U404.15(GND)
V3.3: C400.1 C405.1 C407.1 R405.2 R406.2 U400.8(VCC) U403.1(VDD) U404.16(VCC)
V5A: C401.1 C402.2 U401.8(V+) U402.2(IN)
V5LCD: C411.1 CN400.1(Vc) CN400.2(Vc) CN400.3(Vc)
NetC403_2: C403.2 R402.1 ; port TEMP
NetC404_1: C404.1 U403.2(Cap-RC)
NetC406_1: C406.1 R412.2
NetC408_1: C408.1 U404.3(C1-)
NetC408_2: C408.2 U404.1(C1+)
NetC409_1: C409.1 U404.2(V+)
NetC410_1: C410.1 U404.5(C2-)
NetC410_2: C410.2 U404.4(C2+)
NetC412_2: C412.2 U404.6(V-)
NetCN400_5: CN400.5(RX) R414.2 U404.14(T1OUT)
NetCN400_6: CN400.6(TX) R416.1 U404.8(R2IN)
NetCN400_7: CN400.7(RTS) R415.2 U404.13(R1IN)
NetE400_1: E400.1 ; port S-LCD_RXD
NetE400_3: E400.3 R414.1 U404.11(T1IN) ; port E-LCD-D7
NetE401_1: E401.1 ; port S-LCD_RTS
NetE401_3: E401.3 R415.1 U404.12(R1OUT) ; port E-LCD-D5
NetE402_1: E402.1 ; port S-LCD_TXD
NetE402_3: E402.3 R416.2 U404.9(R2OUT) ; port E-LCD-D6
NetL100_1: R404.2 R407.2 ; port VREF
NetP400_CCW: P400.CCW(-) R404.1 U401.5(IN+) U402.6(OUT)
NetP400_CW: P400.CW(+) R408.1
NetP400_W: P400.W R403.1
NetR400_1: R400.1 R402.2 U401.1(OUT)
NetR400_2: R400.2 R401.1 U401.2(IN-)
NetR403_2: R403.2 U402.5(TRIM)
NetR405_1: R405.1 U400.5(SDA) U403.5(SDA) ; port RTC_SDA
NetR406_1: R406.1 U400.6(SCL) U403.4(SCL) ; port RTC_SCL
NetR407_1: R407.1 R409.2 R411.1
NetR409_1: R409.1 ; port VREF_M
NetR410_1: R410.1 R413.2 U401.6(IN-)
NetR411_2: R411.2 R413.1 U401.7(OUT)
NetR412_1: R412.1 U403.7(Vbackup)
NetU401_3: U401.3(IN+) U402.3(VTEMP)

Not connected (* = marked no-connect by the designer): CN400 4(NC)*; U402 1(NC)* 7(NC)* 8(NC)*; U403 3(CLK/~{INT})* 8(PSW)* 10(~{RST})*; U404 7(T2OUT)* 10(T2IN)*

### Notes on the sheet
- Peripherals 2
- (in symbol AD642JH, part A) A
- (in symbol AD642JH, part B) B

### Library data of the parts
C400 C402-C405 = Cap Semi: as C102 on sheet Xmega; Published: 8-Jun-2000; LatestRevisionDate: 17-Jul-2002; LatestRevisionNote: Re-released for DXP Platform.; PackageReference: C1206; Publisher: Altium Limited
C401 = Cap Pol3: as C100 on sheet Xmega; Published: 8-Jun-2000; LatestRevisionDate: 17-Jul-2002; LatestRevisionNote: Re-released for DXP Platform.; PackageReference: C0805; Publisher: Altium Limited
C406 = Cap Pol2: Polarized Capacitor (Axial); Value: 100pF; Published: 8-Jun-2000; LatestRevisionDate: 17-Jul-2002; LatestRevisionNote: Re-released for DXP Platform.; PackageReference: POLAR0.8; Publisher: Altium Limited
C407-C412 = Cap: Capacitor; Published: 8-Jun-2000; LatestRevisionDate: 17-Jul-2002; LatestRevisionNote: Re-released for DXP Platform.; PackageReference: RAD-0.3; Publisher: Altium Limited
CN400 = Header 5X2: Header, 5-Pin, Dual row; LatestRevisionDate: 17-Jul-2002; LatestRevisionNote: Re-released for DXP Platform.; Publisher: Altium Limited
E400-E402 = Component_1
P400 = RPot SM: Square Trimming Potentiometer; Published: 17-Dec-2003; DatasheetDocument: Oct-2003; PackageReference: POT4MM-2; Publisher: Altium Limited; ComponentLink1Description: Manufacturer Link; ComponentLink1URL: http://bourns.com/2/search.html
R400 R401 R403 R405 R406 R410 R412-R416 = Res Semi: Semiconductor Resistor; Value: 1K; Published: 8-Jun-2000; LatestRevisionDate: 17-Jul-2002; LatestRevisionNote: Re-released for DXP Platform.; PackageReference: AXIAL-0.5; Publisher: Altium Limited
R402 R404 R407-R409 R411 = Res Semi: Semiconductor Resistor; Published: 8-Jun-2000; LatestRevisionDate: 17-Jul-2002; LatestRevisionNote: Re-released for DXP Platform.; PackageReference: AXIAL-0.5; Publisher: Altium Limited; Value: 1K
U400 = AT24HC04BN-SP25-T: 4Kbit (512 x 8), 2-wire Bus Serial Automotive EEPROM with 1/2 memory Write Protect, 2.5V, 8-Pin SOIC, Tape & Reel; Published: 20-Sep-2010; DatasheetVersion: 5192C,  Jan-2009; PackageVersion: revC, Mar-2005; PackageReference: 8S1; Publisher: Altium Limited; PackageDescription: 8-Lead (0.150" Wide Body), Plastic Gull Wing Small Outline (JEDEC SOIC); Code_JEDEC: MS-012-AA; Code_IPC: SOIC127P600-8; ComponentLink1Description: Manufacturer Link; ComponentLink1URL: http://www.atmel.com/products/serial/default.asp; ComponentLink2Description: Datasheet; ComponentLink2URL: http://www.atmel.com/dyn/resources/prod_documents/doc5192.pdf; ComponentLink3Description: Atmel.com Home; ComponentLink3URL: http://www.atmel.com
U401 = AD642JH: Precision, Low Cost Dual BiFET Operational Amplifier; Note: Pin 4 connected to case.; ComponentAvailability: Obsolete; Published: 8-Jun-2000; LatestRevisionDate: 17-Jul-2002; LatestRevisionNote: Re-released for DXP Platform.; DatasheetVersion: REV. 0; PackageVersion: 1990; PackageReference: H-08B; Publisher: Altium Limited; PackageDescription: Can; 8 Leads; Pin Circle Dia. 5.84 mm; Lead Dia. 0.53 mm (max); Code_JEDEC: MO-006-AH; ComponentLink1Description: Manufacturer Link; ComponentLink1URL: http://www.analog.com/; ComponentLink2Description: Datasheet; ComponentLink2URL: http://www.analog.com/UploadedFiles/Obsolete_Data_Sheets/765962AD642.pdf
U402 = REF03GS: +2.5V Precision Voltage Reference; Note: Pins 1, 7 and 8 are not connected; Published: 8-Jun-2000; LatestRevisionDate: 13-Apr-2006; LatestRevisionNote: IPC-7351 Footprint Added.; DatasheetVersion: REV. C 1992; PackageVersion: revA; PackageReference: SO-8; Publisher: Altium Limited; PackageDescription: 8-Pin Small Outline Integrated Circuit 1.27 mm Pitch; Code_JEDEC: MS-012-AA; Code_IPC: SOIC127P600-8; ComponentLink1Description: Manufacturer Link; ComponentLink1URL: http://www.analog.com/en/prod/0%2C2877%2CREF03%2C00.html; ComponentLink2Description: Datasheet; ComponentLink2URL: http://www.analog.com/UploadedFiles/Data_Sheets/56211209654177REF03_f.pdf
U403 = AT90LS2323-4SC: 8-Bit AVR Microcontroller with 2K Bytes of In-System Programmable Flash Memory; Published: 17-Sep-2003; LatestRevisionDate: 13-Apr-2006; LatestRevisionNote: IPC-7351 Footprint Added.; DatasheetVersion: 1004D-09/01; PackageVersion: revB, May-2002; PackageReference: 8S2; Publisher: Altium Limited; PackageDescription: 8-Pin Small Outline Package 1.27 mm Pitch; ComponentLink1Description: Manufacturer Link; ComponentLink1URL: http://www.atmel.com; ComponentLink2Description: Datasheet; ComponentLink2URL: http://www.atmel.com/dyn/resources/prod_documents/doc1004.pdf
U404 = MAX3232CUE: 3.0V TO 5.5V, Low-Power, up to 1Mbps, True RS-232 Transceiver Using Four 0.1µF External Capacitor; Published: 16-Jan-2001; LatestRevisionDate: 29-May-2009; LatestRevisionNote: IPC-7351 Footprint Added.; DatasheetVersion: Mar-1999; PackageVersion: 21-0066 C; PackageReference: TSSOP16; Publisher: Altium Limited; PackageDescription: 16-Pin Thin Small Outline Package 0.65 mm Pitch; ComponentLink1Description: Manufacturer Link; ComponentLink1URL: http://www.maxim-ic.com/; ComponentLink2Description: Datasheet; ComponentLink2URL: http://pdfserv.maxim-ic.com/en/ds/MAX3222-MAX3241.pdf

## Nets that join several sheets
GND: Xmega (27 pins), Peripherals (44 pins), Ethernet & LCD (35 pins), Peripherals 2 (30 pins)
V3.3: Xmega (25 pins), Peripherals (17 pins), Ethernet & LCD (19 pins), Peripherals 2 (8 pins)
V5A: Peripherals (C300.1 C312.2 E300.3), Peripherals 2 (C401.1 C402.2 U401.8 U402.2)
V5LCD: Peripherals (C301.1 C302.2 E301.3), Peripherals 2 (C411.1 CN400.1 CN400.2 CN400.3)
NetC314_2: Xmega (U101.45), Peripherals (C314.2 CN103.1 CN104.1 S301.1)
NetC315_2: Xmega (U101.46), Peripherals (C315.2 CN103.2 CN104.2 S302.1)
NetC316_2: Xmega (U101.47), Peripherals (C316.2 CN103.3 CN104.3 S303.1)
NetC317_2: Xmega (U101.48), Peripherals (C317.2 CN103.4 CN104.4 S304.1)
NetC318_2: Xmega (U101.49), Peripherals (C318.2 CN103.5 CN104.5 S305.1)
NetC319_2: Xmega (U101.50), Peripherals (C319.2 CN103.6 CN104.6 S306.1)
NetC403_2: Xmega (U101.6), Peripherals 2 (C403.2 R402.1)
NetCN102_2: Xmega (U101.98), Peripherals (CN102.2)
NetCN102_3: Xmega (U101.11), Peripherals (CN102.3)
NetCN102_4: Xmega (U101.20), Peripherals (CN102.4)
NetCN102_5: Xmega (U101.12), Peripherals (CN102.5)
NetCN102_6: Xmega (U101.21), Peripherals (CN102.6)
NetCN102_7: Xmega (U101.22), Peripherals (CN102.7)
NetCN102_8: Xmega (U101.39), Peripherals (CN102.8)
NetCN102_9: Xmega (R107.1 U101.25), Peripherals (CN102.9)
NetCN102_10: Xmega (U101.99), Peripherals (CN102.10)
NetCN102_11: Xmega (U101.40), Peripherals (CN102.11)
NetCN102_12: Xmega (R106.1 U101.26), Peripherals (CN102.12)
NetCN102_13: Xmega (U101.87), Peripherals (CN102.13)
NetCN102_14: Xmega (U101.88), Peripherals (CN102.14)
NetCN102_15: Xmega (U101.38), Peripherals (CN102.15)
NetCN102_16: Xmega (U101.77), Peripherals (CN102.16)
NetCN102_17: Xmega (U101.82), Peripherals (CN102.17)
NetCN102_18: Xmega (R108.2 U101.100), Peripherals (CN102.18)
NetCN102_19: Xmega (U101.41), Peripherals (CN102.19)
NetCN102_20: Xmega (U101.9), Peripherals (CN102.20)
NetCN102_21: Xmega (U101.7), Peripherals (CN102.21)
NetCN102_22: Xmega (U101.10), Peripherals (CN102.22)
NetCN102_23: Xmega (U101.8), Peripherals (CN102.23)
NetCN102_27: Xmega (R105.1 U101.15), Peripherals (CN102.27)
NetCN102_29: Xmega (R104.1 U101.16), Peripherals (CN102.29)
NetCN103_7: Xmega (U101.51), Peripherals (CN103.7 CN104.7 R310.1)
NetCN103_8: Xmega (U101.52), Peripherals (CN103.8 CN104.8 R311.1)
NetCN103_10: Xmega (U101.95), Peripherals (CN103.10 R320.1)
NetCN103_12: Xmega (U101.96), Peripherals (CN103.12 R321.1)
NetCN103_14: Xmega (U101.97), Peripherals (CN103.14 R319.1)
NetCN104_10: Xmega (U101.27), Peripherals (CN104.10)
NetCN104_12: Xmega (U101.28), Peripherals (CN104.12)
NetCN104_14: Xmega (U101.37), Peripherals (CN104.14)
NetE400_1: Xmega (U101.18), Peripherals 2 (E400.1)
NetE401_1: Xmega (U101.19), Peripherals 2 (E401.1)
NetE402_1: Xmega (U101.17), Peripherals 2 (E402.1)
NetL100_1: Xmega (L100.1), Peripherals 2 (R404.2 R407.2)
NetLED105_K: Xmega (U101.2), Peripherals (LED105.K)
NetLED106_A: Xmega (U101.86), Peripherals (LED106.A LED108.A R307.1)
NetR102_2: Xmega (R102.2 U101.91), Ethernet & LCD (U201.65)
NetR301_2: Xmega (U101.31), Peripherals (R301.2 SC301.7)
NetR302_2: Xmega (U101.32), Peripherals (R302.2 SC301.5)
NetR303_2: Xmega (U101.30), Peripherals (R303.2 SC301.2)
NetR304_2: Xmega (U101.29), Peripherals (R304.2 SC301.1)
NetR312_1: Xmega (U101.1), Peripherals (R312.1)
NetR315_1: Xmega (U101.85), Peripherals (R315.1)
NetR405_1: Xmega (U101.35), Peripherals 2 (R405.1 U400.5 U403.5)
NetR406_1: Xmega (U101.36), Peripherals 2 (R406.1 U400.6 U403.4)
NetU101_55: Xmega (U101.55), Ethernet & LCD (U201.57)
NetU101_56: Xmega (U101.56), Ethernet & LCD (U201.56)
NetU101_57: Xmega (U101.57), Ethernet & LCD (U201.55)
NetU101_58: Xmega (U101.58), Ethernet & LCD (U201.54)
NetU101_59: Xmega (U101.59), Ethernet & LCD (U201.53)
NetU101_60: Xmega (U101.60), Ethernet & LCD (U201.52)
NetU101_61: Xmega (U101.61), Ethernet & LCD (U201.51)
NetU101_62: Xmega (U101.62), Ethernet & LCD (U201.50)
NetU101_65: Xmega (U101.65), Ethernet & LCD (U201.45)
NetU101_66: Xmega (U101.66), Ethernet & LCD (U201.44)
NetU101_67: Xmega (U101.67), Ethernet & LCD (U201.43)
NetU101_68: Xmega (U101.68), Ethernet & LCD (U201.42)
NetU101_69: Xmega (U101.69), Ethernet & LCD (U201.41)
NetU101_70: Xmega (U101.70), Ethernet & LCD (U201.40)
NetU101_71: Xmega (U101.71), Ethernet & LCD (U201.39)
NetU101_72: Xmega (U101.72), Ethernet & LCD (U201.38)
NetU101_75: Xmega (U101.75), Ethernet & LCD (U201.49)
NetU101_76: Xmega (U101.76), Ethernet & LCD (U201.48)
NetU101_79: Xmega (U101.79), Ethernet & LCD (U201.60)
NetU101_80: Xmega (U101.80), Ethernet & LCD (U201.61)
NetU101_81: Xmega (U101.81), Ethernet & LCD (U201.62)
NetU101_92: Xmega (U101.92), Ethernet & LCD (U201.66)